# EAGLE schematic Water Simulator (EAGLE 7.5.0)
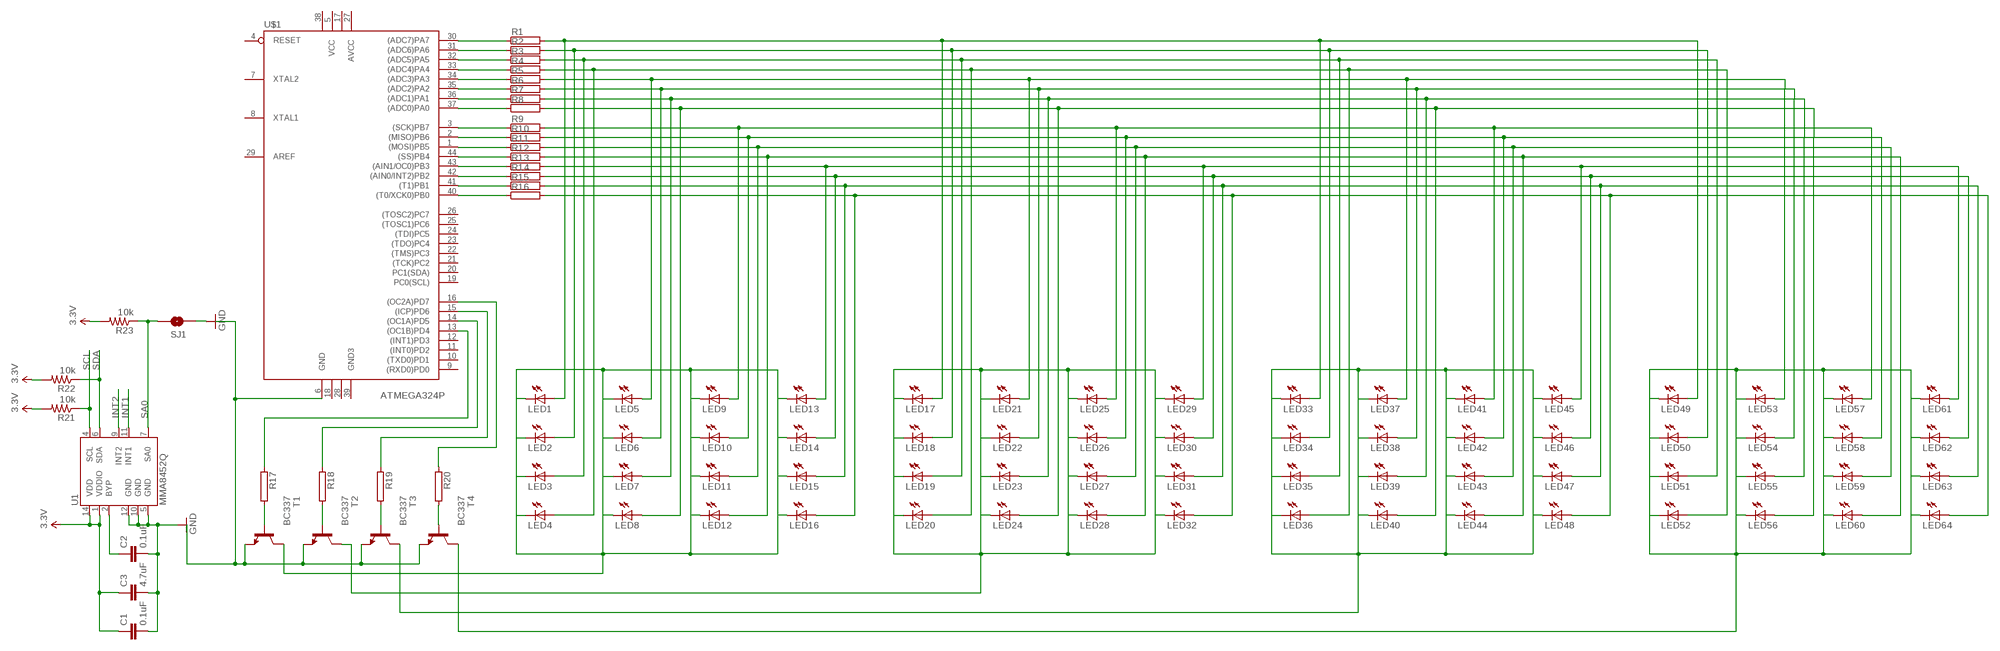
[diagram p0: schematic, sheet 1]

## Parts
C1  0.1uF  CAP0402-CAP  [0402-CAP]
C2  0.1uF  CAP0402-CAP  [0402-CAP]
C3  4.7uF  CAP0402-CAP  [0402-CAP]
LED1  CREE-XLAMP-XM-L  [CREE-XLAMP-XM-L]
LED2  CREE-XLAMP-XM-L  [CREE-XLAMP-XM-L]
LED3  CREE-XLAMP-XM-L  [CREE-XLAMP-XM-L]
LED4  CREE-XLAMP-XM-L  [CREE-XLAMP-XM-L]
LED5  CREE-XLAMP-XM-L  [CREE-XLAMP-XM-L]
LED6  CREE-XLAMP-XM-L  [CREE-XLAMP-XM-L]
LED7  CREE-XLAMP-XM-L  [CREE-XLAMP-XM-L]
LED8  CREE-XLAMP-XM-L  [CREE-XLAMP-XM-L]
LED9  CREE-XLAMP-XM-L  [CREE-XLAMP-XM-L]
LED10  CREE-XLAMP-XM-L  [CREE-XLAMP-XM-L]
LED11  CREE-XLAMP-XM-L  [CREE-XLAMP-XM-L]
LED12  CREE-XLAMP-XM-L  [CREE-XLAMP-XM-L]
LED13  CREE-XLAMP-XM-L  [CREE-XLAMP-XM-L]
LED14  CREE-XLAMP-XM-L  [CREE-XLAMP-XM-L]
LED15  CREE-XLAMP-XM-L  [CREE-XLAMP-XM-L]
LED16  CREE-XLAMP-XM-L  [CREE-XLAMP-XM-L]
LED17  CREE-XLAMP-XM-L  [CREE-XLAMP-XM-L]
LED18  CREE-XLAMP-XM-L  [CREE-XLAMP-XM-L]
LED19  CREE-XLAMP-XM-L  [CREE-XLAMP-XM-L]
LED20  CREE-XLAMP-XM-L  [CREE-XLAMP-XM-L]
LED21  CREE-XLAMP-XM-L  [CREE-XLAMP-XM-L]
LED22  CREE-XLAMP-XM-L  [CREE-XLAMP-XM-L]
LED23  CREE-XLAMP-XM-L  [CREE-XLAMP-XM-L]
LED24  CREE-XLAMP-XM-L  [CREE-XLAMP-XM-L]
LED25  CREE-XLAMP-XM-L  [CREE-XLAMP-XM-L]
LED26  CREE-XLAMP-XM-L  [CREE-XLAMP-XM-L]
LED27  CREE-XLAMP-XM-L  [CREE-XLAMP-XM-L]
LED28  CREE-XLAMP-XM-L  [CREE-XLAMP-XM-L]
LED29  CREE-XLAMP-XM-L  [CREE-XLAMP-XM-L]
LED30  CREE-XLAMP-XM-L  [CREE-XLAMP-XM-L]
LED31  CREE-XLAMP-XM-L  [CREE-XLAMP-XM-L]
LED32  CREE-XLAMP-XM-L  [CREE-XLAMP-XM-L]
LED33  CREE-XLAMP-XM-L  [CREE-XLAMP-XM-L]
LED34  CREE-XLAMP-XM-L  [CREE-XLAMP-XM-L]
LED35  CREE-XLAMP-XM-L  [CREE-XLAMP-XM-L]
LED36  CREE-XLAMP-XM-L  [CREE-XLAMP-XM-L]
LED37  CREE-XLAMP-XM-L  [CREE-XLAMP-XM-L]
LED38  CREE-XLAMP-XM-L  [CREE-XLAMP-XM-L]
LED39  CREE-XLAMP-XM-L  [CREE-XLAMP-XM-L]
LED40  CREE-XLAMP-XM-L  [CREE-XLAMP-XM-L]
LED41  CREE-XLAMP-XM-L  [CREE-XLAMP-XM-L]
LED42  CREE-XLAMP-XM-L  [CREE-XLAMP-XM-L]
LED43  CREE-XLAMP-XM-L  [CREE-XLAMP-XM-L]
LED44  CREE-XLAMP-XM-L  [CREE-XLAMP-XM-L]
LED45  CREE-XLAMP-XM-L  [CREE-XLAMP-XM-L]
LED46  CREE-XLAMP-XM-L  [CREE-XLAMP-XM-L]
LED47  CREE-XLAMP-XM-L  [CREE-XLAMP-XM-L]
LED48  CREE-XLAMP-XM-L  [CREE-XLAMP-XM-L]
LED49  CREE-XLAMP-XM-L  [CREE-XLAMP-XM-L]
LED50  CREE-XLAMP-XM-L  [CREE-XLAMP-XM-L]
LED51  CREE-XLAMP-XM-L  [CREE-XLAMP-XM-L]
LED52  CREE-XLAMP-XM-L  [CREE-XLAMP-XM-L]
LED53  CREE-XLAMP-XM-L  [CREE-XLAMP-XM-L]
LED54  CREE-XLAMP-XM-L  [CREE-XLAMP-XM-L]
LED55  CREE-XLAMP-XM-L  [CREE-XLAMP-XM-L]
LED56  CREE-XLAMP-XM-L  [CREE-XLAMP-XM-L]
LED57  CREE-XLAMP-XM-L  [CREE-XLAMP-XM-L]
LED58  CREE-XLAMP-XM-L  [CREE-XLAMP-XM-L]
LED59  CREE-XLAMP-XM-L  [CREE-XLAMP-XM-L]
LED60  CREE-XLAMP-XM-L  [CREE-XLAMP-XM-L]
LED61  CREE-XLAMP-XM-L  [CREE-XLAMP-XM-L]
LED62  CREE-XLAMP-XM-L  [CREE-XLAMP-XM-L]
LED63  CREE-XLAMP-XM-L  [CREE-XLAMP-XM-L]
LED64  CREE-XLAMP-XM-L  [CREE-XLAMP-XM-L]
R1  RAC01  [AC01]
R2  RAC01  [AC01]
R3  RAC01  [AC01]
R4  RAC01  [AC01]
R5  RAC01  [AC01]
R6  RAC01  [AC01]
R7  RAC01  [AC01]
R8  RAC01  [AC01]
R9  RAC01  [AC01]
R10  RAC01  [AC01]
R11  RAC01  [AC01]
R12  RAC01  [AC01]
R13  RAC01  [AC01]
R14  RAC01  [AC01]
R15  RAC01  [AC01]
R16  RAC01  [AC01]
R17  RAC01  [AC01]
R18  RAC01  [AC01]
R19  RAC01  [AC01]
R20  RAC01  [AC01]
R21  10k  RESISTOR0402-RES  [0402-RES]
R22  10k  RESISTOR0402-RES  [0402-RES]
R23  10k  RESISTOR0402-RES  [0402-RES]
SJ1  SOLDERJUMPERNO  [SJ_2S-NO]
T1  BC337  [TO92]
T2  BC337  [TO92]
T3  BC337  [TO92]
T4  BC337  [TO92]
U1  MMA8452Q  [QFN-16_0.5MM]
U$1  ATMEGA324P  [TQFP-44]

## Nets
3.3V: C1.1 C3.1 R21.2 R22.2 R23.2 U1.1(VDDIO) U1.14(VDD)
BYP: C2.1 U1.2(BYP)
GND: C1.2 C2.2 C3.2 SJ1.1 U1.5(GND) U1.10(GND) U1.12(GND)
INT1: U1.11(INT1)
INT2: U1.9(INT2)
N$1: R9.1 U$1.3((SCK)PB7)
N$2: R2.1 U$1.31((ADC6)PA6)
N$3: R3.1 U$1.32((ADC5)PA5)
N$4: R4.1 U$1.33((ADC4)PA4)
N$5: R5.1 U$1.34((ADC3)PA3)
N$6: R6.1 U$1.35((ADC2)PA2)
N$7: R7.1 U$1.36((ADC1)PA1)
N$8: R8.1 U$1.37((ADC0)PA0)
N$17: R10.1 U$1.2((MISO)PB6)
N$18: R11.1 U$1.1((MOSI)PB5)
N$19: R12.1 U$1.44((SS)PB4)
N$20: R13.1 U$1.43((AIN1/OC0)PB3)
N$21: R14.1 U$1.42((AIN0/INT2)PB2)
N$22: R15.1 U$1.41((T1)PB1)
N$23: R16.1 U$1.40((T0/XCK0)PB0)
N$24: T1.1(E) T2.1(E) T3.1(E) T4.1(E) U$1.6(GND)
N$25: R17.1 U$1.13((OC1B)PD4)
N$26: R17.2 T1.2(B)
N$27: R18.1 U$1.14((OC1A)PD5)
N$28: R18.2 T2.2(B)
N$29: R19.1 U$1.15((ICP)PD6)
N$30: R19.2 T3.2(B)
N$31: R20.2 T4.2(B)
N$32: R20.1 U$1.16((OC2A)PD7)
N$33: LED1.C LED1.C@1(C) LED2.C LED2.C@1(C) LED3.C LED3.C@1(C) LED4.C LED4.C@1(C) LED5.C LED5.C@1(C) LED6.C LED6.C@1(C) LED7.C LED7.C@1(C) LED8.C LED8.C@1(C) LED9.C LED9.C@1(C) LED10.C LED10.C@1(C) LED11.C LED11.C@1(C) LED12.C LED12.C@1(C) LED13.C LED13.C@1(C) LED14.C LED14.C@1(C) LED15.C LED15.C@1(C) LED16.C LED16.C@1(C) T1.3(C)
N$34: LED17.C LED17.C@1(C) LED18.C LED18.C@1(C) LED19.C LED19.C@1(C) LED20.C LED20.C@1(C) LED21.C LED21.C@1(C) LED22.C LED22.C@1(C) LED23.C LED23.C@1(C) LED24.C LED24.C@1(C) LED25.C LED25.C@1(C) LED26.C LED26.C@1(C) LED27.C LED27.C@1(C) LED28.C LED28.C@1(C) LED29.C LED29.C@1(C) LED30.C LED30.C@1(C) LED31.C LED31.C@1(C) LED32.C LED32.C@1(C) T2.3(C)
N$35: LED33.C LED33.C@1(C) LED34.C LED34.C@1(C) LED35.C LED35.C@1(C) LED36.C LED36.C@1(C) LED37.C LED37.C@1(C) LED38.C LED38.C@1(C) LED39.C LED39.C@1(C) LED40.C LED40.C@1(C) LED41.C LED41.C@1(C) LED42.C LED42.C@1(C) LED43.C LED43.C@1(C) LED44.C LED44.C@1(C) LED45.C LED45.C@1(C) LED46.C LED46.C@1(C) LED47.C LED47.C@1(C) LED48.C LED48.C@1(C) T3.3(C)
N$36: LED49.C LED49.C@1(C) LED50.C LED50.C@1(C) LED51.C LED51.C@1(C) LED52.C LED52.C@1(C) LED53.C LED53.C@1(C) LED54.C LED54.C@1(C) LED55.C LED55.C@1(C) LED56.C LED56.C@1(C) LED57.C LED57.C@1(C) LED58.C LED58.C@1(C) LED59.C LED59.C@1(C) LED60.C LED60.C@1(C) LED61.C LED61.C@1(C) LED62.C LED62.C@1(C) LED63.C LED63.C@1(C) LED64.C LED64.C@1(C) T4.3(C)
N$37: LED1.A LED1.A@1(A) LED2.A LED2.A@1(A) LED3.A LED3.A@1(A) LED4.A LED4.A@1(A) LED5.A LED5.A@1(A) LED6.A LED6.A@1(A) LED7.A LED7.A@1(A) LED8.A LED8.A@1(A) LED9.A LED9.A@1(A) LED10.A LED10.A@1(A) LED11.A LED11.A@1(A) LED12.A LED12.A@1(A) LED13.A LED13.A@1(A) LED14.A LED14.A@1(A) LED15.A LED15.A@1(A) LED16.A LED16.A@1(A) LED17.A LED17.A@1(A) LED18.A LED18.A@1(A) LED19.A LED19.A@1(A) LED20.A LED20.A@1(A) LED21.A LED21.A@1(A) LED22.A LED22.A@1(A) LED23.A LED23.A@1(A) LED24.A LED24.A@1(A) LED25.A LED25.A@1(A) LED26.A LED26.A@1(A) LED27.A LED27.A@1(A) LED28.A LED28.A@1(A) LED29.A LED29.A@1(A) LED30.A LED30.A@1(A) LED31.A LED31.A@1(A) LED32.A LED32.A@1(A) LED33.A LED33.A@1(A) LED34.A LED34.A@1(A) LED35.A LED35.A@1(A) LED36.A LED36.A@1(A) LED37.A LED37.A@1(A) LED38.A LED38.A@1(A) LED39.A LED39.A@1(A) LED40.A LED40.A@1(A) LED41.A LED41.A@1(A) LED42.A LED42.A@1(A) LED43.A LED43.A@1(A) LED44.A LED44.A@1(A) LED45.A LED45.A@1(A) LED46.A LED46.A@1(A) LED47.A LED47.A@1(A) LED48.A LED48.A@1(A) LED49.A LED49.A@1(A) LED50.A LED50.A@1(A) LED51.A LED51.A@1(A) LED52.A LED52.A@1(A) LED53.A LED53.A@1(A) LED54.A LED54.A@1(A) LED55.A LED55.A@1(A) LED56.A LED56.A@1(A) LED57.A LED57.A@1(A) LED58.A LED58.A@1(A) LED59.A LED59.A@1(A) LED60.A LED60.A@1(A) LED61.A LED61.A@1(A) LED62.A LED62.A@1(A) LED63.A LED63.A@1(A) LED64.A LED64.A@1(A) R1.2 R9.2 R10.2 R11.2 R12.2 R13.2 R14.2 R15.2 R16.2
R1: R1.1 U$1.30((ADC7)PA7)
SA0: R23.1 SJ1.2 U1.7(SA0)
SCL: R21.1 U1.4(SCL)
SDA: R22.1 U1.6(SDA)
Unconnected: R2.2 R3.2 R4.2 R5.2 R6.2 R7.2 R8.2 U$1.4(RESET) U$1.7(XTAL2) U$1.8(XTAL1) U$1.9((RXD0)PD0) U$1.10((TXD0)PD1) U$1.11((INT0)PD2) U$1.12((INT1)PD3) U$1.19(PC0(SCL)) U$1.20(PC1(SDA)) U$1.21((TCK)PC2) U$1.22((TMS)PC3) U$1.23((TDO)PC4) U$1.24((TDI)PC5) U$1.25((TOSC1)PC6) U$1.26((TOSC2)PC7)

## Power pins joined to a net without a drawn wire
AREF: U$1.29(AREF)
AVCC: U$1.27(AVCC)
GND1: U$1.18(GND1)
GND2: U$1.28(GND2)
GND3: U$1.39(GND3)
VCC: U$1.5(VCC)
VCC1: U$1.17(VCC1)
VCC2: U$1.38(VCC2)

## Library data of the parts
C1-C3 = SparkFun:CAP: Capacitor Standard 0603 ceramic capacitor, and 0.1" leaded capacitor.
LED1-LED64 = led:CREE-XLAMP-XM-L: Cree® XLamp® XM-L LEDs Source: http://www.cree.com
R1-R20 = resistor-power:R: Power Resitor; OC_FARNELL: unknown; OC_NEWARK: unknown
R21-R23 = SparkFun:RESISTOR: Resistor Basic schematic elements and footprints for 0603, 1206, and PTH resistors.
SJ1 = SparkFun:SOLDERJUMPER: Solder Jumper Standard SMD solder jumper. Used to automate production. Two varients : Normally Open and Normally Closed are the same, but have different paste layers. NC will have a large amount of paste and should jumper during reflow.
T1-T4 = transistor:BC337: NPN TRANSISTOR
U1 = SparkFun:MMA8452Q: MMA8452Q 3-Axis, 12/8-bit Digital Accelerometer Supply Voltage: 1.6-3.6V Range: +/- 2g, 4g, 8g Interface: I2C, 12-bit and 8-bit ODR: 1.56 Hz - 800 Hz Package: QFN-16 http://cache.freescale.com/files/sensors/doc/data_sheet/MMA8452Q.pdf
U$1 = ATMega324P:ATMEGA324P